# Altium schematic sheet openGDROM.SchDoc: openGDROM
size D; DrawnBy: Zeigren; Revision: 1; SheetNumber: 1; SheetTotal: 1
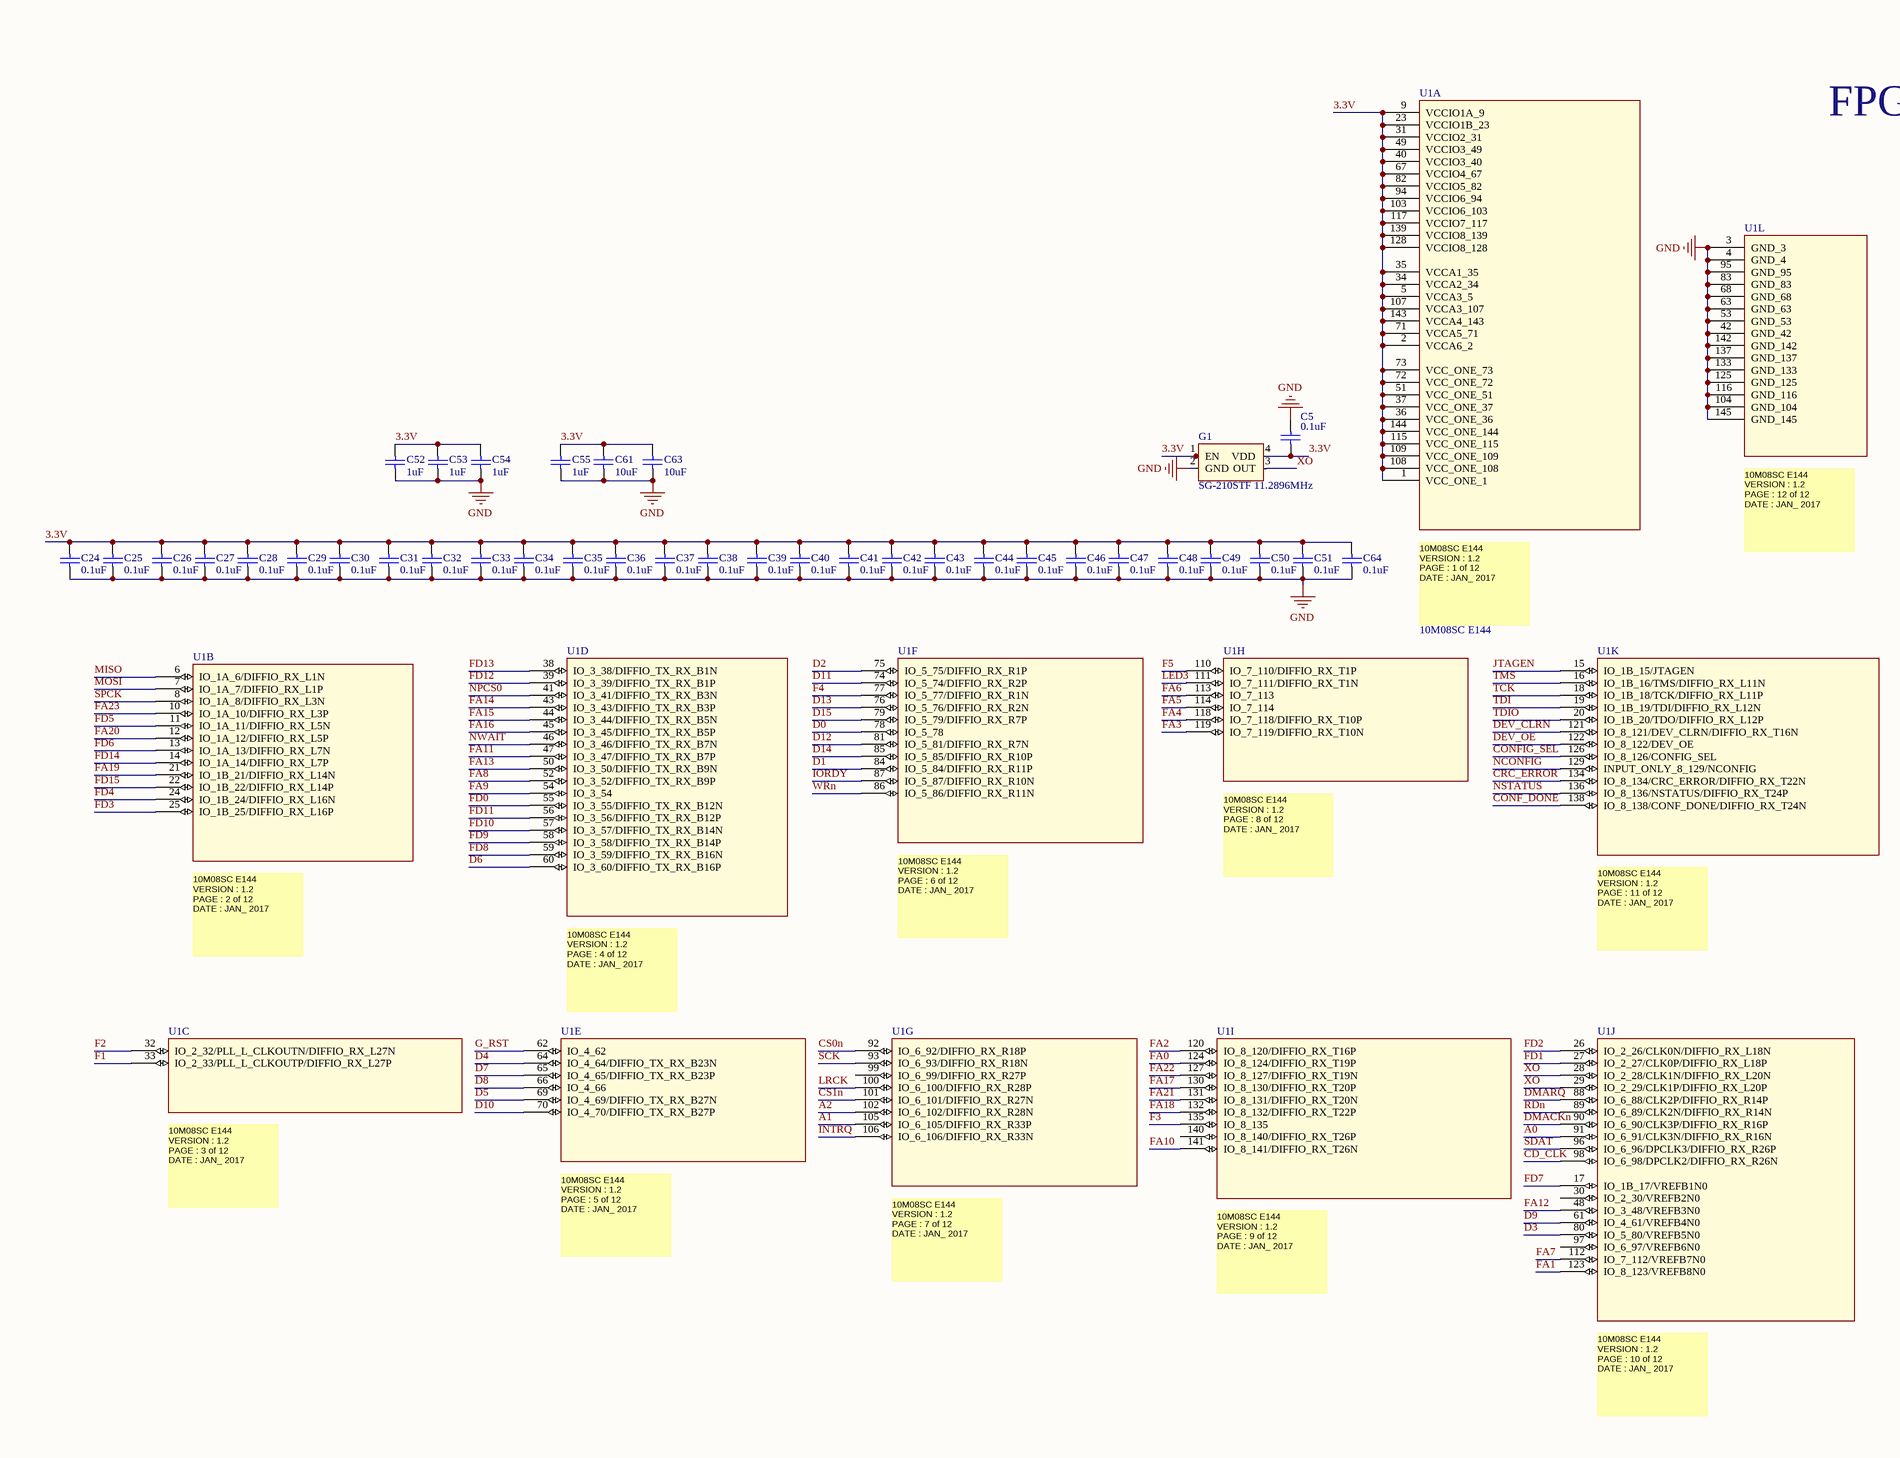
[diagram p0: openGDROM.SchDoc, left]
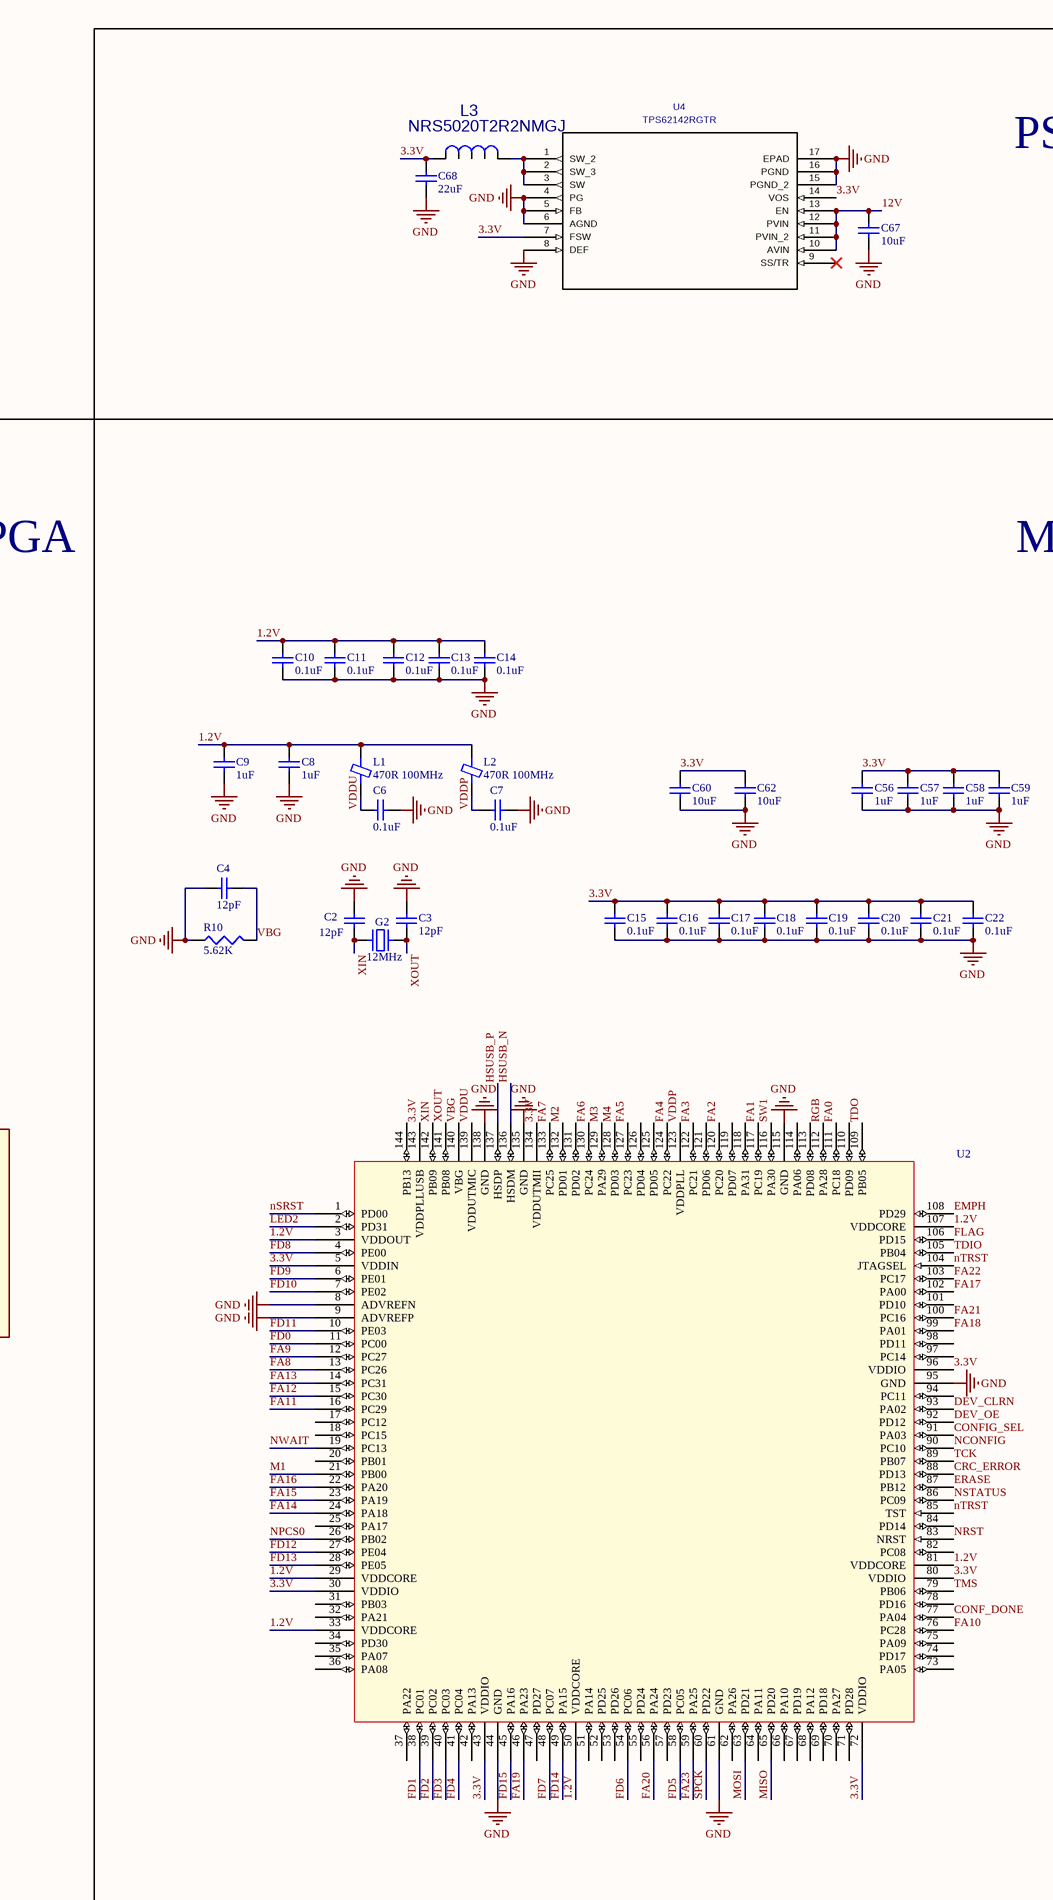
[diagram p1: openGDROM.SchDoc, middle]
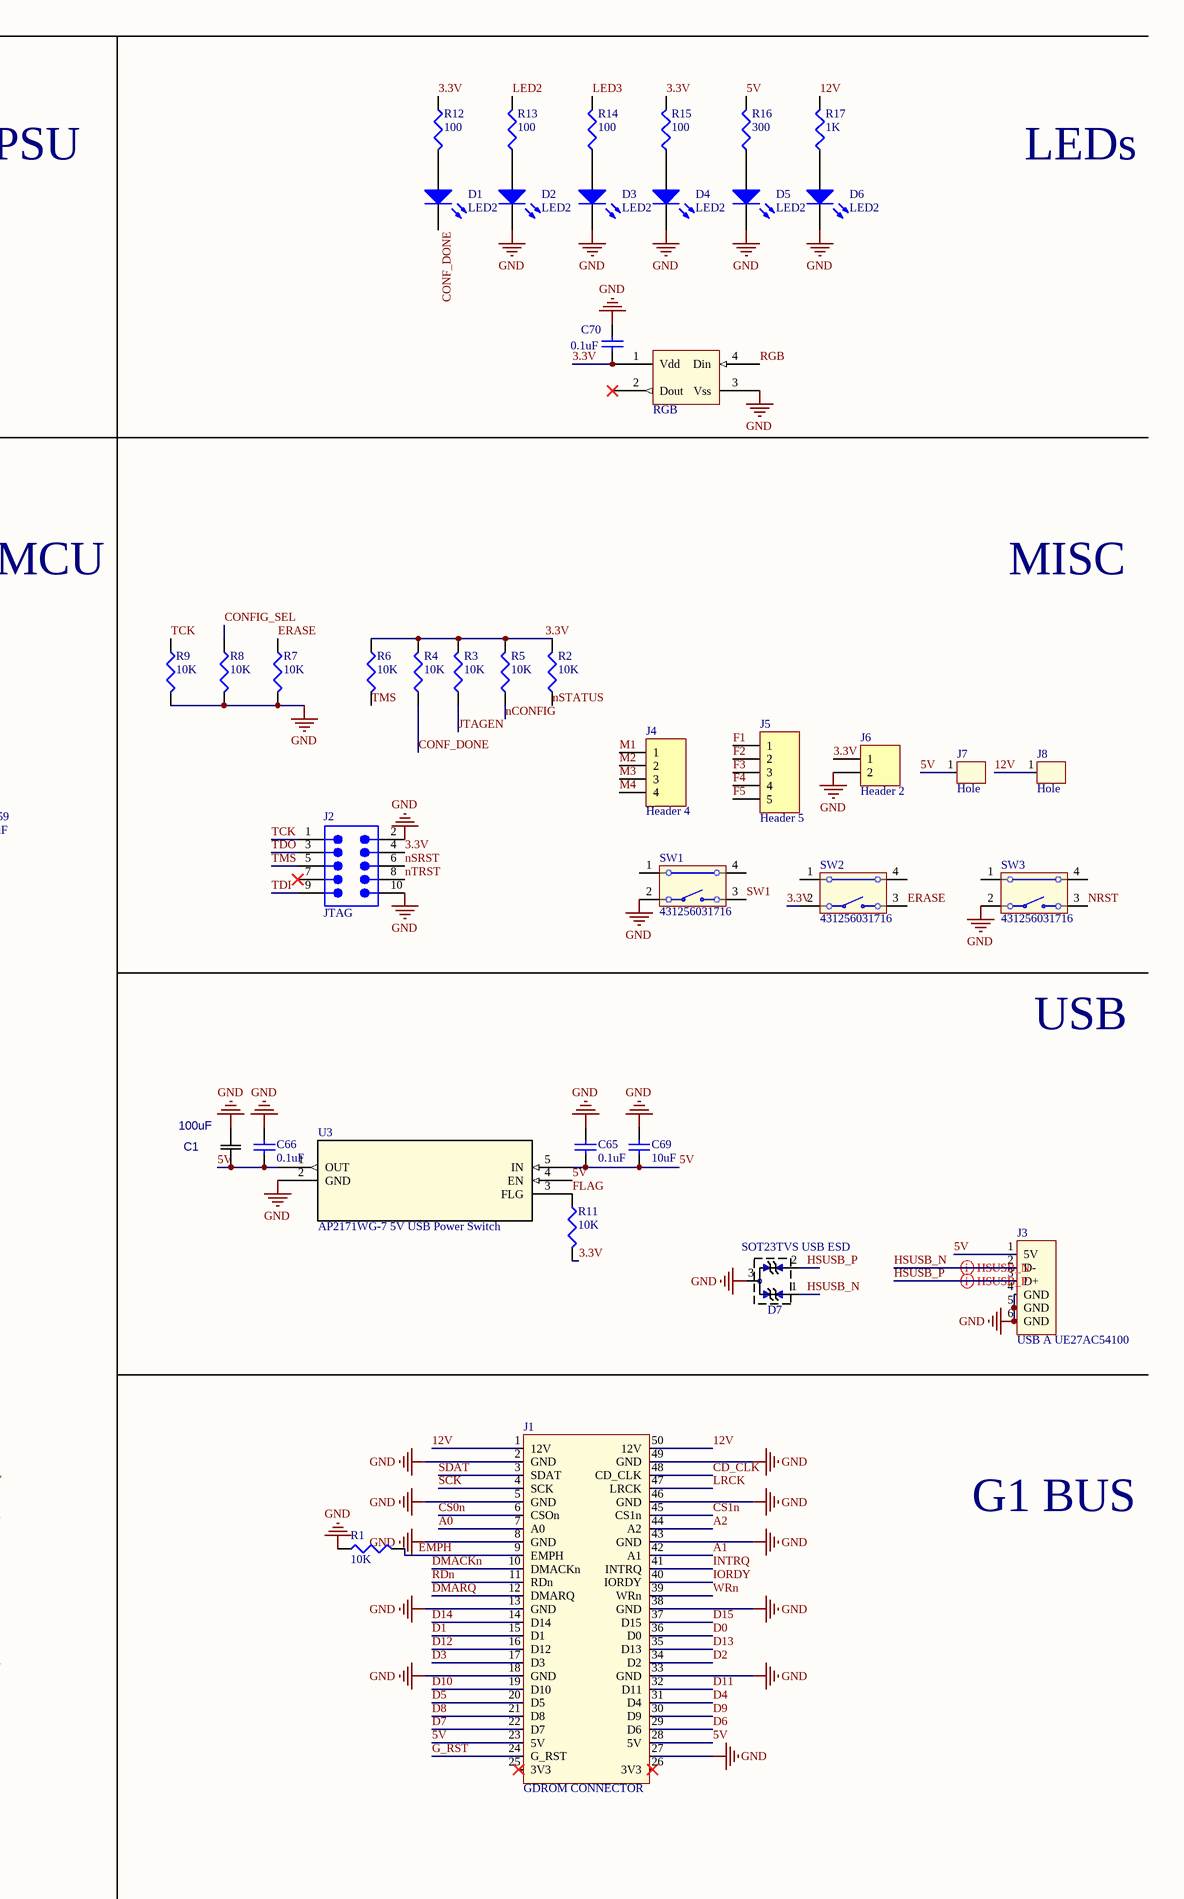
[diagram p2: openGDROM.SchDoc, right]

## Parts
C1  value 100uF  [TAJC]  (hidden comment: TAJC107K016RNJ)
C2  value 12pF  [CAP0402R]  (hidden comment: 0402 Cap)
C3  value 12pF  [CAP0402R]  (hidden comment: 0402 Cap)
C4  value 12pF  [CAP0402R]  (hidden comment: 0402 Cap)
C5  value 0.1uF  [CAP0402R]  (hidden comment: 0402 Cap)
C6  value 0.1uF  [CAP0402R]  (hidden comment: 0402 Cap)
C7  value 0.1uF  [CAP0402R]  (hidden comment: 0402 Cap)
C8  value 1uF  [CAP0603R]  (hidden comment: 0603 Cap)
C9  value 1uF  [CAP0603R]  (hidden comment: 0603 Cap)
C10  value 0.1uF  [CAP0402R]  (hidden comment: 0402 Cap)
C11  value 0.1uF  [CAP0402R]  (hidden comment: 0402 Cap)
C12  value 0.1uF  [CAP0402R]  (hidden comment: 0402 Cap)
C13  value 0.1uF  [CAP0402R]  (hidden comment: 0402 Cap)
C14  value 0.1uF  [CAP0402R]  (hidden comment: 0402 Cap)
C15  value 0.1uF  [CAP0402R]  (hidden comment: 0402 Cap)
C16  value 0.1uF  [CAP0402R]  (hidden comment: 0402 Cap)
C17  value 0.1uF  [CAP0402R]  (hidden comment: 0402 Cap)
C18  value 0.1uF  [CAP0402R]  (hidden comment: 0402 Cap)
C19  value 0.1uF  [CAP0402R]  (hidden comment: 0402 Cap)
C20  value 0.1uF  [CAP0402R]  (hidden comment: 0402 Cap)
C21  value 0.1uF  [CAP0402R]  (hidden comment: 0402 Cap)
C22  value 0.1uF  [CAP0402R]  (hidden comment: 0402 Cap)
C24  value 0.1uF  [CAP0402R]  (hidden comment: 0402 Cap)
C25  value 0.1uF  [CAP0402R]  (hidden comment: 0402 Cap)
C26  value 0.1uF  [CAP0402R]  (hidden comment: 0402 Cap)
C27  value 0.1uF  [CAP0402R]  (hidden comment: 0402 Cap)
C28  value 0.1uF  [CAP0402R]  (hidden comment: 0402 Cap)
C29  value 0.1uF  [CAP0402R]  (hidden comment: 0402 Cap)
C30  value 0.1uF  [CAP0402R]  (hidden comment: 0402 Cap)
C31  value 0.1uF  [CAP0402R]  (hidden comment: 0402 Cap)
C32  value 0.1uF  [CAP0402R]  (hidden comment: 0402 Cap)
C33  value 0.1uF  [CAP0402R]  (hidden comment: 0402 Cap)
C34  value 0.1uF  [CAP0402R]  (hidden comment: 0402 Cap)
C35  value 0.1uF  [CAP0402R]  (hidden comment: 0402 Cap)
C36  value 0.1uF  [CAP0402R]  (hidden comment: 0402 Cap)
C37  value 0.1uF  [CAP0402R]  (hidden comment: 0402 Cap)
C38  value 0.1uF  [CAP0402R]  (hidden comment: 0402 Cap)
C39  value 0.1uF  [CAP0402R]  (hidden comment: 0402 Cap)
C40  value 0.1uF  [CAP0402R]  (hidden comment: 0402 Cap)
C41  value 0.1uF  [CAP0402R]  (hidden comment: 0402 Cap)
C42  value 0.1uF  [CAP0402R]  (hidden comment: 0402 Cap)
C43  value 0.1uF  [CAP0402R]  (hidden comment: 0402 Cap)
C44  value 0.1uF  [CAP0402R]  (hidden comment: 0402 Cap)
C45  value 0.1uF  [CAP0402R]  (hidden comment: 0402 Cap)
C46  value 0.1uF  [CAP0402R]  (hidden comment: 0402 Cap)
C47  value 0.1uF  [CAP0402R]  (hidden comment: 0402 Cap)
C48  value 0.1uF  [CAP0402R]  (hidden comment: 0402 Cap)
C49  value 0.1uF  [CAP0402R]  (hidden comment: 0402 Cap)
C50  value 0.1uF  [CAP0402R]  (hidden comment: 0402 Cap)
C51  value 0.1uF  [CAP0402R]  (hidden comment: 0402 Cap)
C52  value 1uF  [CAP0603R]  (hidden comment: 0603 Cap)
C53  value 1uF  [CAP0603R]  (hidden comment: 0603 Cap)
C54  value 1uF  [CAP0603R]  (hidden comment: 0603 Cap)
C55  value 1uF  [CAP0603R]  (hidden comment: 0603 Cap)
C56  value 1uF  [CAP0603R]  (hidden comment: 0603 Cap)
C57  value 1uF  [CAP0603R]  (hidden comment: 0603 Cap)
C58  value 1uF  [CAP0603R]  (hidden comment: 0603 Cap)
C59  value 1uF  [CAP0603R]  (hidden comment: 0603 Cap)
C60  value 10uF  [CAP0805R]  (hidden comment: 0805 Cap)
C61  value 10uF  [CAP0805R]  (hidden comment: 0805 Cap)
C62  value 10uF  [CAP0805R]  (hidden comment: 0805 Cap)
C63  value 10uF  [CAP0805R]  (hidden comment: 0805 Cap)
C64  value 0.1uF  [CAP0402R]  (hidden comment: 0402 Cap)
C65  value 0.1uF  [CAP0402R]  (hidden comment: 0402 Cap)
C66  value 0.1uF  [CAP0402R]  (hidden comment: 0402 Cap)
C67  value 10uF  [CAP0805R]  (hidden comment: 0805 Cap)
C68  value 22uF  [CAP0805R]  (hidden comment: 0805 Cap)
C69  value 10uF  [CAP0805R]  (hidden comment: 0805 Cap)
C70  value 0.1uF  [CAP0402R]  (hidden comment: 0402 Cap)
D1  LED2  [LED 603]
D2  LED2  [LED 603]
D3  LED2  [LED 603]
D4  LED2  [LED 603]
D5  LED2  [LED 603]
D6  LED2  [LED 603]
D7  SOT23TVS USB ESD  [SOT23TVS]
G1  SG-210STF 11.2896MHz  [KC2520K]
G2  12MHz  [ABRACON ABLS]
J1  GDROM CONNECTOR  [GDROMCONN]
J2  JTAG  [SMTC-ZSS-105-01-X-D-450]
J3  USB A UE27AC54100  [USB A]
J4  Header 4  [HDR1X4]
J5  Header 5  [HDR1X5]
J6  Header 2  [HDR1X2]
J7  Hole  [1.2MM HOLE]
J8  Hole  [1.2MM HOLE]
L1  470R 100MHz  [FER 0805/2012]
L2  470R 100MHz  [FER 0805/2012]
L3  NRS5020T2R2NMGJ  [IND_TAIYO_NRS502]
R1  value 10K  [RES0402R]  (hidden comment: 0402 Resistor)
R2  value 10K  [RES0402R]  (hidden comment: 0402 Resistor)
R3  value 10K  [RES0402R]  (hidden comment: 0402 Resistor)
R4  value 10K  [RES0402R]  (hidden comment: 0402 Resistor)
R5  value 10K  [RES0402R]  (hidden comment: 0402 Resistor)
R6  value 10K  [RES0402R]  (hidden comment: 0402 Resistor)
R7  value 10K  [RES0402R]  (hidden comment: 0402 Resistor)
R8  value 10K  [RES0402R]  (hidden comment: 0402 Resistor)
R9  value 10K  [RES0402R]  (hidden comment: 0402 Resistor)
R10  value 5.62K  [RES0402R]  (hidden comment: 0402 Resistor)
R11  value 10K  [RES0402R]  (hidden comment: 0402 Resistor)
R12  value 100  [RES0402R]  (hidden comment: 0402 Resistor)
R13  value 100  [RES0402R]  (hidden comment: 0402 Resistor)
R14  value 100  [RES0402R]  (hidden comment: 0402 Resistor)
R15  value 100  [RES0402R]  (hidden comment: 0402 Resistor)
R16  value 300  [RES0402R]  (hidden comment: 0402 Resistor)
R17  value 1K  [RES0805R]  (hidden comment: 0805 Resistor)
RGB  WS2812B  [WS2812B]  (value not drawn)
SW1  431256031716  [431256031716]
SW2  431256031716  [431256031716]
SW3  431256031716  [431256031716]
U1  10M08SC E144  [EQFP144_A-165_D2-54_N]  (parts A,B,C,D,E,F,G,H,I,J,K,L of 12)
U2  Revision B  [144L1_N]  (value not drawn)
U3  AP2171WG-7 5V USB Power Switch  [SOT25]
U4  TPS62142RGTR  [RGT16_1P7X1P7]

## Nets
GND: C1.2 C2.1 C3.1 C4.1 C5.2 C6.2 C7.2 C8.1 C9.1 C10.1 C11.1 C12.1 C13.1 C14.1 C15.1 C16.1 C17.1 C18.1 C19.1 C20.1 C21.1 C22.1 C24.1 C25.1 C26.1 C27.1 C28.1 C29.1 C30.1 C31.1 C32.1 C33.1 C34.1 C35.1 C36.1 C37.1 C38.1 C39.1 C40.1 C41.1 C42.1 C43.1 C44.1 C45.1 C46.1 C47.1 C48.1 C49.1 C50.1 C51.1 C52.1 C53.1 C54.1 C55.1 C56.1 C57.1 C58.1 C59.1 C60.1 C61.1 C62.1 C63.1 C64.1 C65.2 C66.2 C67.1 C68.1 C69.2 C70.1 D2.2(K) D3.2(K) D4.2(K) D5.2(K) D6.2(K) D7.3(GND) G1.2(GND) J1.2(GND) J1.5(GND) J1.8(GND) J1.13(GND) J1.18(GND) J1.27 J1.33(GND) J1.38(GND) J1.43(GND) J1.46(GND) J1.49(GND) J2.2 J2.10 J3.4(GND) J3.5(GND) J3.6(GND) J6.2 R1.1 R7.2 R8.2 R9.2 R10.1 RGB.3(Vss) SW1.2 SW3.2 U1.3(GND_3) U1.4(GND_4) U1.42(GND_42) U1.53(GND_53) U1.63(GND_63) U1.68(GND_68) U1.83(GND_83) U1.95(GND_95) U1.104(GND_104) U1.116(GND_116) U1.125(GND_125) U1.133(GND_133) U1.137(GND_137) U1.142(GND_142) U1.145(GND_145) U2.8(ADVREFN) U2.9(ADVREFP) U2.44(GND) U2.61(GND) U2.95(GND) U2.115(GND) U2.135(GND) U2.138(GND) U3.2(GND) U4.4(PG) U4.5(FB) U4.6(AGND) U4.8(DEF) U4.15(PGND_2) U4.16(PGND) U4.17(EPAD)
1.2V: C8.2 C9.2 C10.2 C11.2 C12.2 C13.2 C14.2 L1.2 L2.2 U2.3(VDDOUT) U2.29(VDDCORE) U2.33(VDDCORE) U2.50(VDDCORE) U2.81(VDDCORE) U2.107(VDDCORE)
3.3V: C5.1 C15.2 C16.2 C17.2 C18.2 C19.2 C20.2 C21.2 C22.2 C24.2 C25.2 C26.2 C27.2 C28.2 C29.2 C30.2 C31.2 C32.2 C33.2 C34.2 C35.2 C36.2 C37.2 C38.2 C39.2 C40.2 C41.2 C42.2 C43.2 C44.2 C45.2 C46.2 C47.2 C48.2 C49.2 C50.2 C51.2 C52.2 C53.2 C54.2 C55.2 C56.2 C57.2 C58.2 C59.2 C60.2 C61.2 C62.2 C63.2 C64.2 C68.2 C70.2 G1.1(EN) G1.4(VDD) J2.4 J6.1 L3.2 R2.2 R3.2 R4.2 R5.2 R6.1 R11.2 R12.1 R15.2 RGB.1(Vdd) SW2.2 U1.1(VCC_ONE_1) U1.2(VCCA6_2) U1.5(VCCA3_5) U1.9(VCCIO1A_9) U1.23(VCCIO1B_23) U1.31(VCCIO2_31) U1.34(VCCA2_34) U1.35(VCCA1_35) U1.36(VCC_ONE_36) U1.37(VCC_ONE_37) U1.40(VCCIO3_40) U1.49(VCCIO3_49) U1.51(VCC_ONE_51) U1.67(VCCIO4_67) U1.71(VCCA5_71) U1.72(VCC_ONE_72) U1.73(VCC_ONE_73) U1.82(VCCIO5_82) U1.94(VCCIO6_94) U1.103(VCCIO6_103) U1.107(VCCA3_107) U1.108(VCC_ONE_108) U1.109(VCC_ONE_109) U1.115(VCC_ONE_115) U1.117(VCCIO7_117) U1.128(VCCIO8_128) U1.139(VCCIO8_139) U1.143(VCCA4_143) U1.144(VCC_ONE_144) U2.5(VDDIN) U2.30(VDDIO) U2.43(VDDIO) U2.72(VDDIO) U2.80(VDDIO) U2.96(VDDIO) U2.134(VDDUTMII) U2.143(VDDPLLUSB) U4.7(FSW) U4.14(VOS)
5V: C1.1 C65.1 C66.1 C69.1 J1.23(5V) J1.28(5V) J3.1(5V) J7.1 R16.2 U3.1(OUT) U3.4(EN) U3.5(IN)
12V: C67.2 J1.1(12V) J1.50(12V) J8.1 R17.2 U4.10(AVIN) U4.11(PVIN_2) U4.12(PVIN) U4.13(EN)
A0: J1.7(A0) U1.91(IO_6_91/CLK3N/DIFFIO_RX_R16N)
A1: J1.42(A1) U1.105(IO_6_105/DIFFIO_RX_R33P)
A2: J1.44(A2) U1.102(IO_6_102/DIFFIO_RX_R28N)
CD_CLK: J1.48(CD_CLK) U1.98(IO_6_98/DPCLK2/DIFFIO_RX_R26N)
CONF_DONE: D1.2(K) R4.1 U1.138(IO_8_138/CONF_DONE/DIFFIO_RX_T24N) U2.77(PA04)
CONFIG_SEL: R8.1 U1.126(IO_8_126/CONFIG_SEL) U2.91(PA03)
CRC_ERROR: U1.134(IO_8_134/CRC_ERROR/DIFFIO_RX_T22N) U2.88(PD13)
CS0n: J1.6(CSOn) U1.92(IO_6_92/DIFFIO_RX_R18P)
CS1n: J1.45(CS1n) U1.101(IO_6_101/DIFFIO_RX_R27N)
D0: J1.36(D0) U1.78(IO_5_78)
D1: J1.15(D1) U1.84(IO_5_84/DIFFIO_RX_R11P)
D2: J1.34(D2) U1.75(IO_5_75/DIFFIO_RX_R1P)
D3: J1.17(D3) U1.80(IO_5_80/VREFB5N0)
D4: J1.31(D4) U1.64(IO_4_64/DIFFIO_TX_RX_B23N)
D5: J1.20(D5) U1.69(IO_4_69/DIFFIO_TX_RX_B27N)
D6: J1.29(D6) U1.60(IO_3_60/DIFFIO_TX_RX_B16P)
D7: J1.22(D7) U1.65(IO_4_65/DIFFIO_TX_RX_B23P)
D8: J1.21(D8) U1.66(IO_4_66)
D9: J1.30(D9) U1.61(IO_4_61/VREFB4N0)
D10: J1.19(D10) U1.70(IO_4_70/DIFFIO_TX_RX_B27P)
D11: J1.32(D11) U1.74(IO_5_74/DIFFIO_RX_R2P)
D12: J1.16(D12) U1.81(IO_5_81/DIFFIO_RX_R7N)
D13: J1.35(D13) U1.76(IO_5_76/DIFFIO_RX_R2N)
D14: J1.14(D14) U1.85(IO_5_85/DIFFIO_RX_R10P)
D15: J1.37(D15) U1.79(IO_5_79/DIFFIO_RX_R7P)
DEV_CLRN: U1.121(IO_8_121/DEV_CLRN/DIFFIO_RX_T16N) U2.93(PA02)
DEV_OE: U1.122(IO_8_122/DEV_OE) U2.92(PD12)
DMACKn: J1.10(DMACKn) U1.90(IO_6_90/CLK3P/DIFFIO_RX_R16P)
DMARQ: J1.12(DMARQ) U1.88(IO_6_88/CLK2P/DIFFIO_RX_R14P)
EMPH: J1.9(EMPH) R1.2 U2.108(PD29)
ERASE: R7.1 SW2.3 U2.87(PB12)
F1: J5.1 U1.33(IO_2_33/PLL_L_CLKOUTP/DIFFIO_RX_L27P)
F2: J5.2 U1.32(IO_2_32/PLL_L_CLKOUTN/DIFFIO_RX_L27N)
F3: J5.3 U1.135(IO_8_135)
F4: J5.4 U1.77(IO_5_77/DIFFIO_RX_R1N)
F5: J5.5 U1.110(IO_7_110/DIFFIO_RX_T1P)
FA0: U1.124(IO_8_124/DIFFIO_RX_T19P) U2.111(PC18)
FA1: U1.123(IO_8_123/VREFB8N0) U2.117(PC19)
FA2: U1.120(IO_8_120/DIFFIO_RX_T16P) U2.120(PC20)
FA3: U1.119(IO_7_119/DIFFIO_RX_T10N) U2.122(PC21)
FA4: U1.118(IO_7_118/DIFFIO_RX_T10P) U2.124(PC22)
FA5: U1.114(IO_7_114) U2.127(PC23)
FA6: U1.113(IO_7_113) U2.130(PC24)
FA7: U1.112(IO_7_112/VREFB7N0) U2.133(PC25)
FA8: U1.52(IO_3_52/DIFFIO_TX_RX_B9P) U2.13(PC26)
FA9: U1.54(IO_3_54) U2.12(PC27)
FA10: U1.141(IO_8_141/DIFFIO_RX_T26N) U2.76(PC28)
FA11: U1.47(IO_3_47/DIFFIO_TX_RX_B7P) U2.16(PC29)
FA12: U1.48(IO_3_48/VREFB3N0) U2.15(PC30)
FA13: U1.50(IO_3_50/DIFFIO_TX_RX_B9N) U2.14(PC31)
FA14: U1.43(IO_3_43/DIFFIO_TX_RX_B3P) U2.24(PA18)
FA15: U1.44(IO_3_44/DIFFIO_TX_RX_B5N) U2.23(PA19)
FA16: U1.45(IO_3_45/DIFFIO_TX_RX_B5P) U2.22(PA20)
FA17: U1.130(IO_8_130/DIFFIO_RX_T20P) U2.102(PA00)
FA18: U1.132(IO_8_132/DIFFIO_RX_T22P) U2.99(PA01)
FA19: U1.21(IO_1B_21/DIFFIO_RX_L14N) U2.46(PA23)
FA20: U1.12(IO_1A_12/DIFFIO_RX_L5P) U2.56(PA24)
FA21: U1.131(IO_8_131/DIFFIO_RX_T20N) U2.100(PC16)
FA22: U1.127(IO_8_127/DIFFIO_RX_T19N) U2.103(PC17)
FA23: U1.10(IO_1A_10/DIFFIO_RX_L3P) U2.59(PA25)
FD0: U1.55(IO_3_55/DIFFIO_TX_RX_B12N) U2.11(PC00)
FD1: U1.27(IO_2_27/CLK0P/DIFFIO_RX_L18P) U2.38(PC01)
FD2: U1.26(IO_2_26/CLK0N/DIFFIO_RX_L18N) U2.39(PC02)
FD3: U1.25(IO_1B_25/DIFFIO_RX_L16P) U2.40(PC03)
FD4: U1.24(IO_1B_24/DIFFIO_RX_L16N) U2.41(PC04)
FD5: U1.11(IO_1A_11/DIFFIO_RX_L5N) U2.58(PC05)
FD6: U1.13(IO_1A_13/DIFFIO_RX_L7N) U2.54(PC06)
FD7: U1.17(IO_1B_17/VREFB1N0) U2.48(PC07)
FD8: U1.59(IO_3_59/DIFFIO_TX_RX_B16N) U2.4(PE00)
FD9: U1.58(IO_3_58/DIFFIO_TX_RX_B14P) U2.6(PE01)
FD10: U1.57(IO_3_57/DIFFIO_TX_RX_B14N) U2.7(PE02)
FD11: U1.56(IO_3_56/DIFFIO_TX_RX_B12P) U2.10(PE03)
FD12: U1.39(IO_3_39/DIFFIO_TX_RX_B1P) U2.27(PE04)
FD13: U1.38(IO_3_38/DIFFIO_TX_RX_B1N) U2.28(PE05)
FD14: U1.14(IO_1A_14/DIFFIO_RX_L7P) U2.49(PA15)
FD15: U1.22(IO_1B_22/DIFFIO_RX_L14P) U2.45(PA16)
FLAG: R11.1 U2.106(PD15) U3.3(FLG)
G_RST: J1.24(G_RST) U1.62(IO_4_62)
HSUSB_N: D7.1(I/O1) J3.2(D-) U2.136(HSDM)
HSUSB_P: D7.2(I/O2) J3.3(D+) U2.137(HSDP)
INTRQ: J1.41(INTRQ) U1.106(IO_6_106/DIFFIO_RX_R33N)
IORDY: J1.40(IORDY) U1.87(IO_5_87/DIFFIO_RX_R10N)
JTAGEN: R3.1 U1.15(IO_1B_15/JTAGEN)
LED2: R13.2 U2.2(PD31)
LED3: R14.2 U1.111(IO_7_111/DIFFIO_RX_T1N)
LRCK: J1.47(LRCK) U1.100(IO_6_100/DIFFIO_RX_R28P)
M1: J4.1 U2.21(PB00)
M2: J4.2 U2.132(PD01)
M3: J4.3 U2.129(PA29)
M4: J4.4 U2.128(PD03)
MISO: U1.6(IO_1A_6/DIFFIO_RX_L1N) U2.65(PD20)
MOSI: U1.7(IO_1A_7/DIFFIO_RX_L1P) U2.63(PD21)
NCONFIG: R5.1 U1.129(INPUT_ONLY_8_129/NCONFIG) U2.90(PC10)
NPCS0: U1.41(IO_3_41/DIFFIO_TX_RX_B3N) U2.26(PB02)
NRST: SW3.3 U2.83(NRST)
nSRST: J2.6 U2.1(PD00)
NSTATUS: R2.1 U1.136(IO_8_136/NSTATUS/DIFFIO_RX_T24P) U2.86(PC09)
nTRST: J2.8 U2.85(TST) U2.104(JTAGSEL)
NWAIT: U1.46(IO_3_46/DIFFIO_TX_RX_B7N) U2.19(PC13)
RDn: J1.11(RDn) U1.89(IO_6_89/CLK2N/DIFFIO_RX_R14N)
RGB: RGB.4(Din) U2.112(PA28)
SCK: J1.4(SCK) U1.93(IO_6_93/DIFFIO_RX_R18N)
SDAT: J1.3(SDAT) U1.96(IO_6_96/DPCLK3/DIFFIO_RX_R26P)
SPCK: U1.8(IO_1A_8/DIFFIO_RX_L3N) U2.60(PD22)
SW1: SW1.3 U2.116(PA30)
TCK: J2.1 R9.1 U1.18(IO_1B_18/TCK/DIFFIO_RX_L11P) U2.89(PB07)
TDI: J2.9 U1.19(IO_1B_19/TDI/DIFFIO_RX_L12N)
TDIO: U1.20(IO_1B_20/TDO/DIFFIO_RX_L12P) U2.105(PB04)
TDO: J2.3 U2.109(PB05)
TMS: J2.5 R6.2 U1.16(IO_1B_16/TMS/DIFFIO_RX_L11N) U2.79(PB06)
VBG: C4.2 R10.2 U2.140(VBG)
VDDP: C7.1 L2.1 U2.123(VDDPLL)
VDDU: C6.1 L1.1 U2.139(VDDUTMIC)
WRn: J1.39(WRn) U1.86(IO_5_86/DIFFIO_RX_R11N)
XIN: C2.2 G2.1 U2.142(PB09)
XO: G1.3(OUT) U1.28(IO_2_28/CLK1N/DIFFIO_RX_L20N) U1.29(IO_2_29/CLK1P/DIFFIO_RX_L20P)
XOUT: C3.2 G2.2 U2.141(PB08)
NetD1_1: D1.1(A) R12.2
NetD2_1: D2.1(A) R13.1
NetD3_1: D3.1(A) R14.1
NetD4_1: D4.1(A) R15.1
NetD5_1: D5.1(A) R16.1
NetD6_1: D6.1(A) R17.1
NetL3_1: L3.1 U4.1(SW_2) U4.2(SW_3) U4.3(SW)

Not connected (* = marked no-connect by the designer): J1 25(3V3) 26(3V3)*; J2 7*; RGB 2(Dout)*; SW1 1 4; SW2 1 4; SW3 1 4; U1 30(IO_2_30/VREFB2N0) 97(IO_6_97/VREFB6N0) 99(IO_6_99/DIFFIO_RX_R27P) 140(IO_8_140/DIFFIO_RX_T26P); U2 17(PC12) 18(PC15) 20(PB01) 25(PA17) 31(PB03) 32(PA21) 34(PD30) 35(PA07) 36(PA08) 37(PA22) 42(PA13) 47(PD27) 51(PA14) 52(PD25) 53(PD26) 55(PD24) 57(PD23) 62(PA26) 64(PA11) 66(PA10) 67(PD19) 68(PA12) 69(PD18) 70(PA27) 71(PD28) 73(PA05) 74(PD17) 75(PA09) 78(PD16) 82(PC08) 84(PD14) 94(PC11) 97(PC14) 98(PD11) 101(PD10) 110(PD09) 113(PD08) 114(PA06) 118(PA31) 119(PD07) 121(PD06) 125(PD05) 126(PD04) 131(PD02) 144(PB13); U4 9(SS/TR)*

## Layout directives
differential pair: HSUSB_N, HSUSB_P

## Notes on the sheet
- PSU
- LEDs
- FPGA
- MCU
- MISC
- USB
- G1 BUS
- Copyright Zeigren 2019. www.zeigren.com
  This documentation describes Open Hardware and is licensed under the CERN OHL v.1.2.
  You may redistribute and modify this documentation under the terms of the CERN OHL v.1.2.(http://ohwr.org/cernohl).
  This documentation is distributed WITHOUT ANY EXPRESS OR IMPLIED WARRANTY, INCLUDING OF MERCHANTABILITY, SATISFACTORY QUALITY AND FITNESS FOR A PARTICULAR PURPOSE.
  Please see the CERN OHL v.1.2 for applicable conditions
- Drawn By:
- Date:
- File:
- Time:
- Size:
- D
- Revision:
- Sheet:
- of
- (in symbol 10M08SC E144, part A) 10M08SC E144 / VERSION : 1.2 / PAGE : 1 of 12 / DATE : JAN_ 2017 /
- (in symbol 10M08SC E144, part B) 10M08SC E144 / VERSION : 1.2 / PAGE : 2 of 12 / DATE : JAN_ 2017 /
- (in symbol 10M08SC E144, part C) 10M08SC E144 / VERSION : 1.2 / PAGE : 3 of 12 / DATE : JAN_ 2017 /
- (in symbol 10M08SC E144, part D) 10M08SC E144 / VERSION : 1.2 / PAGE : 4 of 12 / DATE : JAN_ 2017 /
- (in symbol 10M08SC E144, part E) 10M08SC E144 / VERSION : 1.2 / PAGE : 5 of 12 / DATE : JAN_ 2017 /
- (in symbol 10M08SC E144, part F) 10M08SC E144 / VERSION : 1.2 / PAGE : 6 of 12 / DATE : JAN_ 2017 /
- (in symbol 10M08SC E144, part G) 10M08SC E144 / VERSION : 1.2 / PAGE : 7 of 12 / DATE : JAN_ 2017 /
- (in symbol 10M08SC E144, part H) 10M08SC E144 / VERSION : 1.2 / PAGE : 8 of 12 / DATE : JAN_ 2017 /
- (in symbol 10M08SC E144, part I) 10M08SC E144 / VERSION : 1.2 / PAGE : 9 of 12 / DATE : JAN_ 2017 /
- (in symbol 10M08SC E144, part J) 10M08SC E144 / VERSION : 1.2 / PAGE : 10 of 12 / DATE : JAN_ 2017 /
- (in symbol 10M08SC E144, part K) 10M08SC E144 / VERSION : 1.2 / PAGE : 11 of 12 / DATE : JAN_ 2017 /
- (in symbol 10M08SC E144, part L) 10M08SC E144 / VERSION : 1.2 / PAGE : 12 of 12 / DATE : JAN_ 2017 /

## Library data of the parts
C1 = TAJC107K016RNJ: C: Copyright (C) 2015 Accelerated Designs. All rights reserved; Vendor: AVX Corporation; Built_By: EMA_UL_Team; Manufacturer_Part_Number: TAJC107K016RNJ
C2-C7 C10-C22 C24-C51 C64-C66 C70 = 0402 Cap: Capacitor; Published: 8-Jun-2000; LatestRevisionDate: 17-Jul-2002; LatestRevisionNote: Re-released for DXP Platform.; PackageReference: RAD-0.3; Publisher: Altium Limited; PackageDescription: Radial Cap, Thru-Hole; 2 Leads; 0.3 in Pin Spacing
C8 C9 C52-C59 = 0603 Cap: Capacitor; Published: 8-Jun-2000; LatestRevisionDate: 17-Jul-2002; LatestRevisionNote: Re-released for DXP Platform.; PackageReference: RAD-0.3; Publisher: Altium Limited; PackageDescription: Radial Cap, Thru-Hole; 2 Leads; 0.3 in Pin Spacing
C60-C63 C67-C69 = 0805 Cap: Polarized Capacitor (Surface Mount); Published: 8-Jun-2000; LatestRevisionDate: 29-May-2009; LatestRevisionNote: IPC-7351 Footprint Added.; PackageReference: C0805; Publisher: Altium Limited; PackageDescription: Chip Capacitor
D1-D6 = LED2: Typical RED, GREEN, YELLOW, AMBER GaAs LED; Published: 8-Jun-2000; LatestRevisionDate: 17-Jul-2002; LatestRevisionNote: Re-released for DXP Platform.; PackageVersion: Feb-2002; PackageReference: 3.2X1.6X1.1; Publisher: Altium Limited; PackageDescription: SM LED; 2 Flat Leads
D7 = SOT23TVS: TVS diode; MF: Wurth Electronics; MP: 824022; Availability: Good; Price: 0.53 USD; Package: SOT-23 WÃ¼rth Elektronik; VALUE: *
G1 = KC2520K OSC
G2 = ABLS-12.000MHZ-B2-T: CRYSTAL 12.0000MHZ 18PF SMD; Manufacturer: Abracon LLC; Frequency Stability: 50ppm; Frequency Tolerance: 20ppm; ESR: 50 Ohm; Operating Mode: Fundamental; Part Number: ABLS-12.000MHZ-B2-T; PartId: 8548; Supplier 1: Digi-Key; Supplier Part Number 1: 535-9067-2-ND; ComponentLink1Description: Datasheet; ComponentLink1URL: http://www.abracon.com/Resonators/abls.pdf; ComponentLink2Description: Digi-Key Listing; ComponentLink2URL: https://www.digikey.com/product-detail/en/ABLS-12.000MHZ-B2-T/535-9067-2-ND/675262; Price: 0.144; Type: MHz Crystal; Device Package: HC49/US; Series: ABLS; Frequency: 12MHz; Load Capacitance: 18pF
J1 = GDROM CONN 52602-0579
J2 = ZSS-105-01-F-D-450: Shrouded .025" SQ Post Header, Through-hole, Vertical, -55 to 125 degC, 2.54 mm Pitch, 10-Pin, Male, RoHS; Manufacturer: Samtec; Pitch: 2.54 mm; DatasheetVersion: F-214; PackageVersion: V, 3/2013; PackageReference: ZSS-105-01-X-D-450; PackageDescription: ZSS-Assembly; Orientation: Vertical; RoHS: True; Temperature Range: -55 to 125 degC; Mounting Technology: Through-hole; PartNumber: ZSS-105-01-F-D-450; ComponentLink1Description: Manufacturer URL; ComponentLink1URL: http://www.samtec.com; ComponentLink2Description: Datasheet; ComponentLink2URL: http://www.samtec.com/documents/webfiles/pdf/ZSS_TH.PDF; ComponentLink3Description: Package Specification; ComponentLink3URL: http://www.samtec.com/documents/webfiles/cpdf/ZSS-1XX-XX-XXX-X-XXXX-XX-XX-MKT.pdf
J4 = Header 4: Header, 4-Pin; LatestRevisionDate: 17-Jul-2002; LatestRevisionNote: Re-released for DXP Platform.; Publisher: Altium Limited
J5 = Header 5: Header, 5-Pin; LatestRevisionDate: 17-Jul-2002; LatestRevisionNote: Re-released for DXP Platform.; Publisher: Altium Limited
J6 = Header 2: Header, 2-Pin; LatestRevisionDate: 17-Jul-2002; LatestRevisionNote: Re-released for DXP Platform.; Publisher: Altium Limited
L1 L2 = 1-1624117-0: FERRITE CHIP 220 OHM 250MA 0805; Manufacturer: TE Connectivity AMP Connectors; Value: 220 Ohm @ 100MHz; Type: Differential Mode - Single; DC Resistance: 500 mOhm Max; Part Number: 1-1624117-0; PartId: 6825; Supplier 1: Digi-Key; Supplier Part Number 1: A103650TR-ND; ComponentLink1Description: Datasheet; ComponentLink1URL: http://www.te.com/commerce/DocumentDelivery/DDEController?Action=srchrtrv&DocNm=1773178&DocType=DS&DocLang=English; ComponentLink2Description: Digi-Key listing; ComponentLink2URL: http://digikey.com/product-detail/en/1-1624117-0/A103650TR-ND/2055834; Price: 0.0445; Device Package: 0805 (2012 Metric); Current Rating: 250mA
L3 = NRS5020T2R2NMGJ: C: Copyright (C) 2015 Accelerated Designs. All rights reserved; Vendor: TAIYO YUDEN; Built_By: EMA_UL_Team; Manufacturer_Part_Number: NRS5020T2R2NMGJ; Value: NRS5020T2R2NMGJ
R17 = 0805 Resistor: Resistor; Published: 8-Jun-2000; LatestRevisionDate: 29-May-2009; LatestRevisionNote: IPC-7351 Footprint Added.; PackageReference: J1-0603; Publisher: Altium Limited; PackageDescription: Chip Resistor
SW1-SW3 = 431256031716: WS-TATU THT Tact Switch 6X6 mm right angle type with ground terminal; NoPins: 04; PackageReference: 431256031716; PartNumber: 431256031716; ComponentLink1Description: Manufacturer URL; ComponentLink1URL: http://www.we-online.com; ComponentLink2Description: Datasheet; ComponentLink2URL: http://katalog.we-online.de/em/datasheet/43125603x.pdf
U1 = 10M08SC E144: SPLIT_INST: TRUE; SWAP_INFO: (S1+S2+S3+S4+S5+S6+S7+S8+S9+S10+S11+S12)
U2 = SAMV7_LQFP144: SAM 32-bit ARM Cortex-M* RISC MCU, SAMV71B Series, QFP144; PartGroup: Integrated Circuits,MCU, MPU, DSP,ARM MCU; Manufacturer: MICROCHIP; MPN: ATSAMV71Q21B-AAB; AN: A06-1541; TemperatureRange: -40Â°C to +105Â°C; Value: SAMV71Q21B; Height: 1,60000002384186
U3 = AP2171WG-7: Imported; Vendor: Diodes Inc; Built_By: EMA_UL_Team; Manufacturer_Part_Number: AP2171WG-7; Value: Value; Type: Type; RefDes: RefDes
U4 = TPS62142RGTR: C: Copyright (C) 2015 Accelerated Designs. All rights reserved; Vendor: Texas Instruments; Built_By: EMA_UL_Team; Value: TPS62142RGTR; Manufacturer_Part_Number: TPS62142RGTR; Manufacturer: Texas Instruments
R1-R16 = 0402 Resistor: Published: 8-Jun-2000; LatestRevisionDate: 29-May-2009; LatestRevisionNote: IPC-7351 Footprint Added.; PackageReference: J1-0603; Publisher: Altium Limited; PackageDescription: Chip Resistor